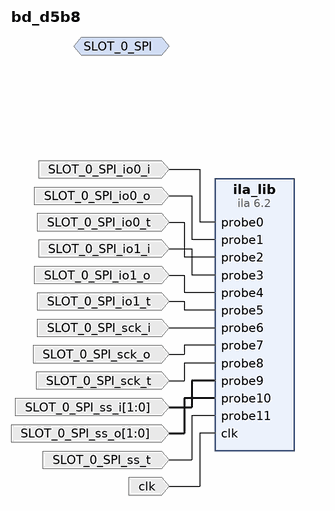
[diagram p0: block diagram of the top level]
# Vivado block design bd_d5b8, xc7z010clg400-1, Vivado 2025.1
create_bd_design bd_d5b8

create_bd_intf_port -mode Monitor -vlnv xilinx.com:interface:spi_rtl:1.0 SLOT_0_SPI
create_bd_port -dir I -type clk clk
set_property -dict {CONFIG.ASSOCIATED_BUSIF SLOT_0_AXI CONFIG.ASSOCIATED_RESET resetn} [get_bd_ports clk]
create_bd_port -dir I SLOT_0_SPI_io0_i
create_bd_port -dir I SLOT_0_SPI_io0_o
create_bd_port -dir I SLOT_0_SPI_io0_t
create_bd_port -dir I SLOT_0_SPI_io1_i
create_bd_port -dir I SLOT_0_SPI_io1_o
create_bd_port -dir I SLOT_0_SPI_io1_t
create_bd_port -dir I SLOT_0_SPI_sck_i
create_bd_port -dir I SLOT_0_SPI_sck_o
create_bd_port -dir I SLOT_0_SPI_sck_t
create_bd_port -dir I -from 1 -to 0 SLOT_0_SPI_ss_i
create_bd_port -dir I -from 1 -to 0 SLOT_0_SPI_ss_o
create_bd_port -dir I SLOT_0_SPI_ss_t

create_bd_cell -type ip -vlnv xilinx.com:ip:ila:6.2 ila_lib
set_property -dict [list \
  CONFIG.ALL_PROBE_SAME_MU TRUE \
  CONFIG.ALL_PROBE_SAME_MU_CNT 1 \
  CONFIG.C_ADV_TRIGGER FALSE \
  CONFIG.C_DATA_DEPTH 1024 \
  CONFIG.C_EN_STRG_QUAL 0 \
  CONFIG.C_ILA_CLK_FREQ 125000000 \
  CONFIG.C_INPUT_PIPE_STAGES 0 \
  CONFIG.C_MONITOR_TYPE Native \
  CONFIG.C_NUM_OF_PROBES 12 \
  CONFIG.C_PROBE0_TYPE 0 \
  CONFIG.C_PROBE0_WIDTH 1 \
  CONFIG.C_PROBE10_TYPE 0 \
  CONFIG.C_PROBE10_WIDTH 2 \
  CONFIG.C_PROBE11_TYPE 0 \
  CONFIG.C_PROBE11_WIDTH 1 \
  CONFIG.C_PROBE1_TYPE 0 \
  CONFIG.C_PROBE1_WIDTH 1 \
  CONFIG.C_PROBE2_TYPE 0 \
  CONFIG.C_PROBE2_WIDTH 1 \
  CONFIG.C_PROBE3_TYPE 0 \
  CONFIG.C_PROBE3_WIDTH 1 \
  CONFIG.C_PROBE4_TYPE 0 \
  CONFIG.C_PROBE4_WIDTH 1 \
  CONFIG.C_PROBE5_TYPE 0 \
  CONFIG.C_PROBE5_WIDTH 1 \
  CONFIG.C_PROBE6_TYPE 0 \
  CONFIG.C_PROBE6_WIDTH 1 \
  CONFIG.C_PROBE7_TYPE 0 \
  CONFIG.C_PROBE7_WIDTH 1 \
  CONFIG.C_PROBE8_TYPE 0 \
  CONFIG.C_PROBE8_WIDTH 1 \
  CONFIG.C_PROBE9_TYPE 0 \
  CONFIG.C_PROBE9_WIDTH 2 \
  CONFIG.C_TRIGIN_EN false \
  CONFIG.C_TRIGOUT_EN false \
  CONFIG.C_XLNX_HW_PROBE_INFO DEFAULT \
] [get_bd_cells ila_lib]

# ---- connections ----

connect_bd_net [get_bd_ports SLOT_0_SPI_io0_i] [get_bd_pins ila_lib/probe0]
connect_bd_net [get_bd_ports SLOT_0_SPI_io0_o] [get_bd_pins ila_lib/probe1]
connect_bd_net [get_bd_ports SLOT_0_SPI_io0_t] [get_bd_pins ila_lib/probe2]
connect_bd_net [get_bd_ports SLOT_0_SPI_io1_i] [get_bd_pins ila_lib/probe3]
connect_bd_net [get_bd_ports SLOT_0_SPI_io1_o] [get_bd_pins ila_lib/probe4]
connect_bd_net [get_bd_ports SLOT_0_SPI_io1_t] [get_bd_pins ila_lib/probe5]
connect_bd_net [get_bd_ports SLOT_0_SPI_sck_i] [get_bd_pins ila_lib/probe6]
connect_bd_net [get_bd_ports SLOT_0_SPI_sck_o] [get_bd_pins ila_lib/probe7]
connect_bd_net [get_bd_ports SLOT_0_SPI_sck_t] [get_bd_pins ila_lib/probe8]
connect_bd_net [get_bd_ports SLOT_0_SPI_ss_i] [get_bd_pins ila_lib/probe9]
connect_bd_net [get_bd_ports SLOT_0_SPI_ss_o] [get_bd_pins ila_lib/probe10]
connect_bd_net [get_bd_ports SLOT_0_SPI_ss_t] [get_bd_pins ila_lib/probe11]
connect_bd_net [get_bd_ports clk] [get_bd_pins ila_lib/clk]

validate_bd_design
save_bd_design
